# Altium project pca10184.PrjPcb (part 4 of 5)

## Sheet pca10184_connectors.SchDoc: =ProductName + ' - Connectors'
size A3; Organization: Nordic Semiconductor; DocumentNumber: 8; Revision: 0.7.0; SheetNumber: 8; SheetTotal: 9; Author: GETR; CompanyName: Nordic Semiconductor; DrawnBy: GETR; DocumentSize: A3; ProjectName: pca10184.PrjPcb
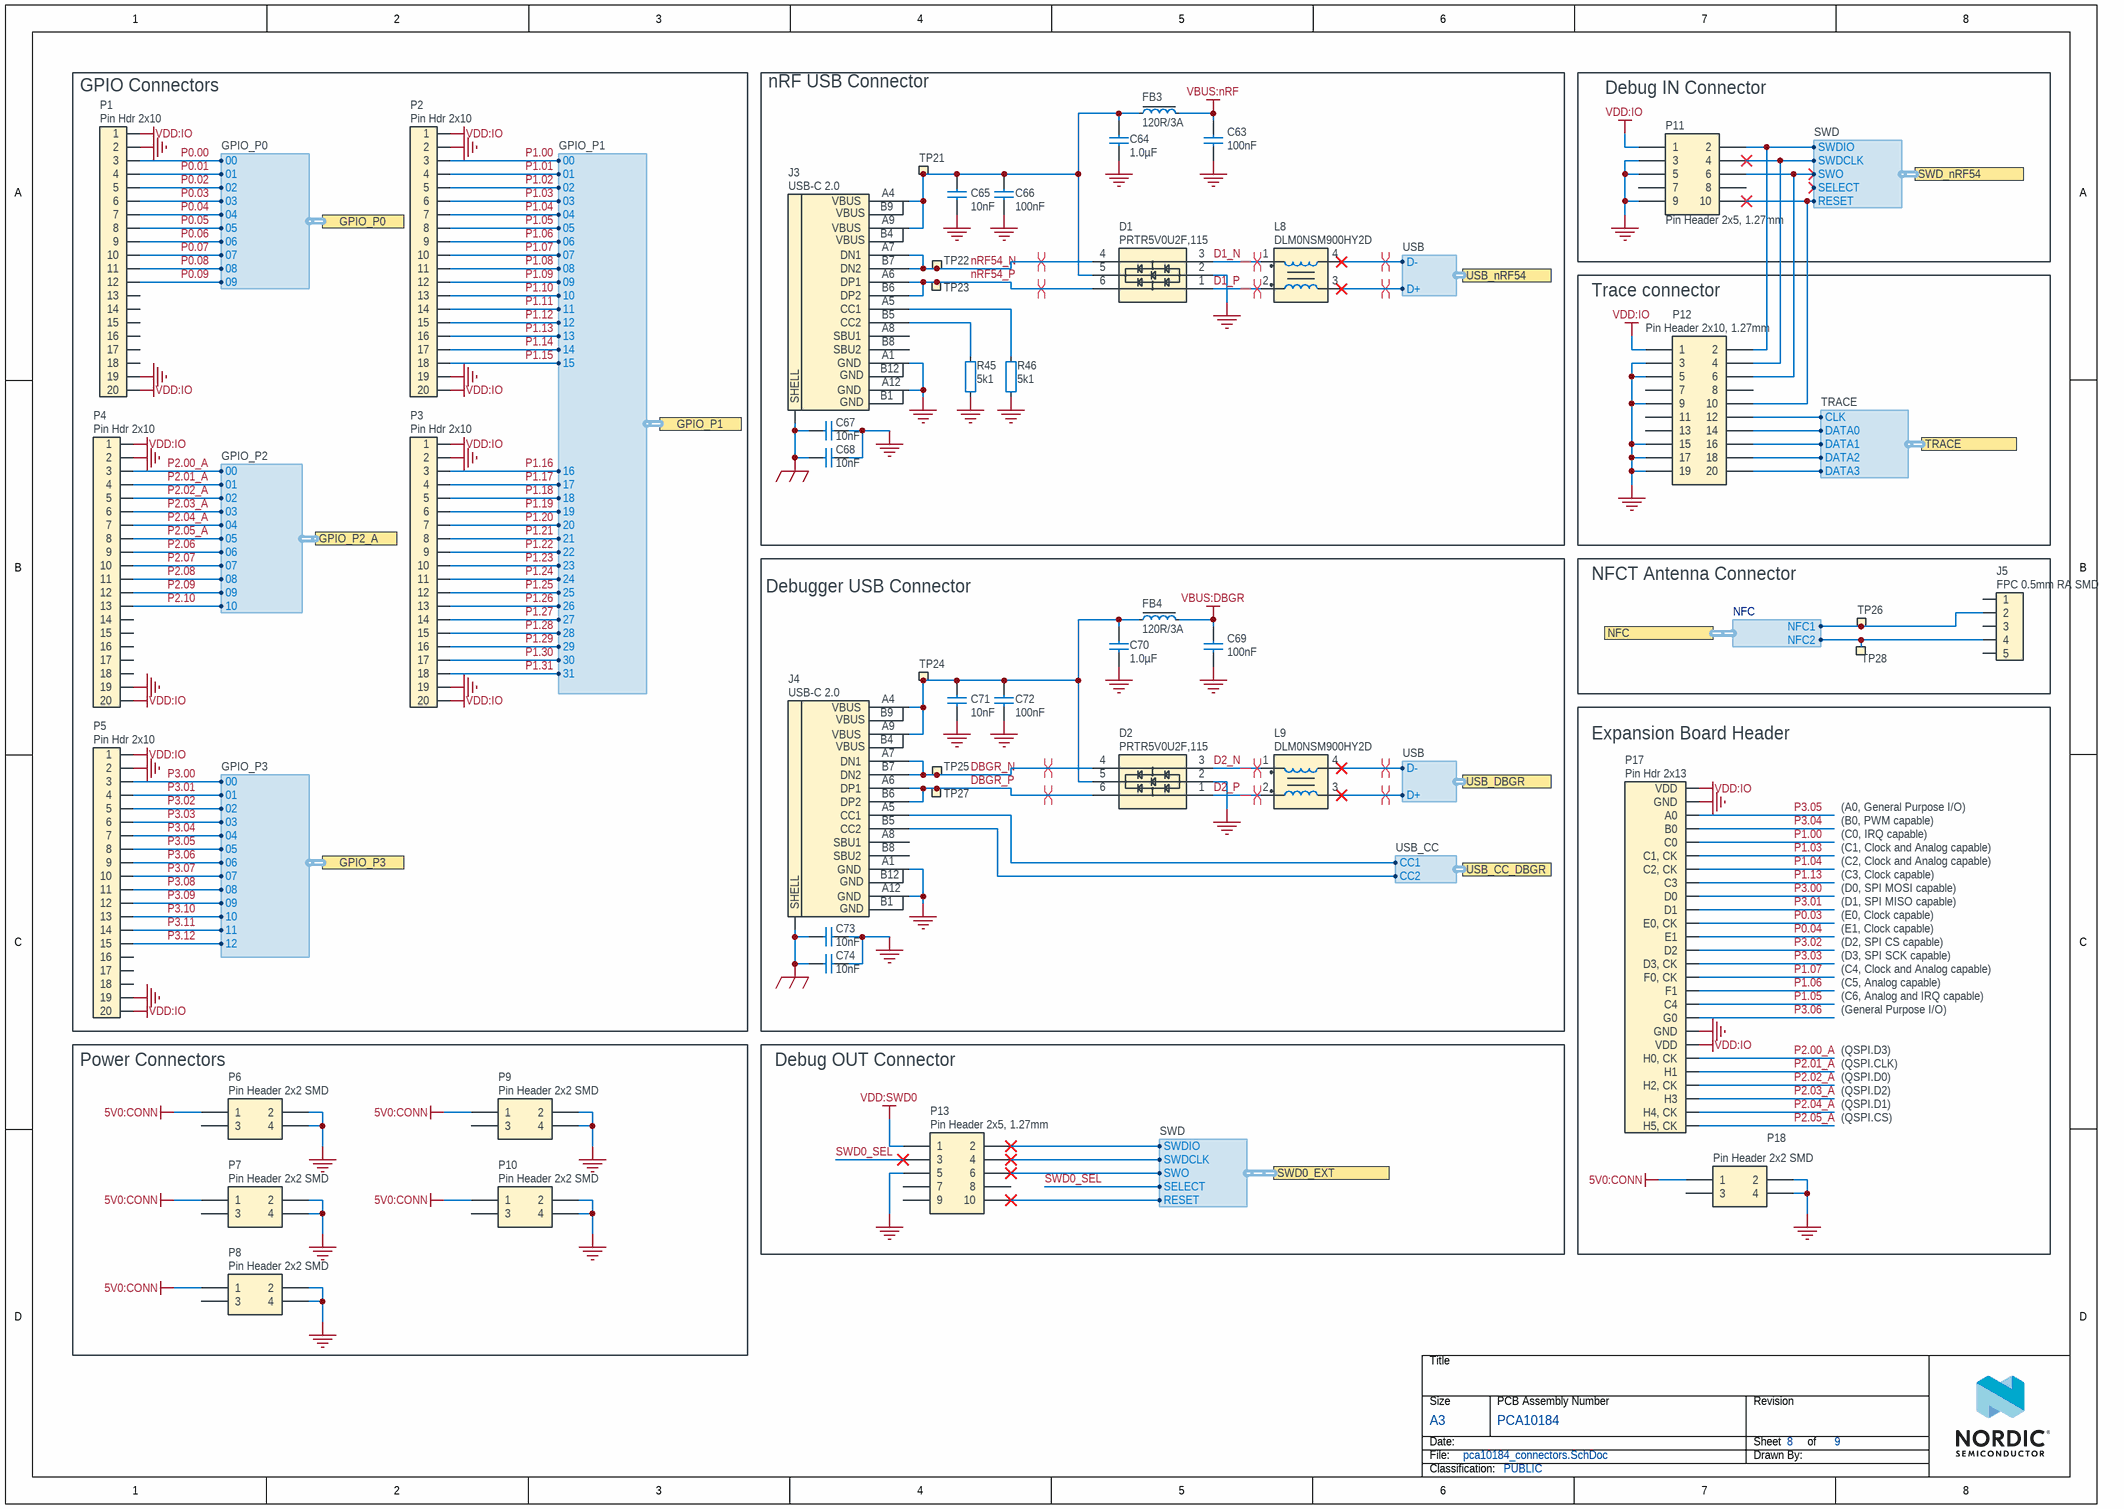
[diagram p4: pca10184_connectors.SchDoc]

### Parts
C63  100nF  [CAPC0603X03L_C]
C64  1.0µF  [CAPC1005X04L]
C65  10nF  [CAPC0603X03L_C]
C66  100nF  [CAPC0603X03L_C]
C67  10nF  [CAPC1005X04L]
C68  10nF  [CAPC1005X04L]
C69  100nF  [CAPC0603X03L_C]
C70  1.0µF  [CAPC1005X04L]
C71  10nF  [CAPC0603X03L_C]
C72  100nF  [CAPC0603X03L_C]
C73  10nF  [CAPC1005X04L]
C74  10nF  [CAPC1005X04L]
D1  PRTR5V0U2F,115  [SON50P100X50-6N]
D2  PRTR5V0U2F,115  [SON50P100X50-6N]
FB3  120R/3A  [INDC1608X06L]
FB4  120R/3A  [INDC1608X06L]
J3  USB-C 2.0  [SD-80259-001]
J4  USB-C 2.0  [SD-80259-001]
J5  FPC 0.5mm RA SMD  [FPC_05P-0.5mm-RA-SMD]
L8  DLM0NSM900HY2D  [CMC0806X05N]
L9  DLM0NSM900HY2D  [CMC0806X05N]
P1  Pin Hdr 2x10  [HDR_2x10-SMD]
P2  Pin Hdr 2x10  [HDR_2x10-SMD]
P3  Pin Hdr 2x10  [HDR_2x10-SMD]
P4  Pin Hdr 2x10  [HDR_2x10-SMD]
P5  Pin Hdr 2x10  [HDR_2x10-SMD]
P6  Pin Header 2x2 SMD  [HDR_2x2-SMD]
P7  Pin Header 2x2 SMD  [HDR_2x2-SMD]
P8  Pin Header 2x2 SMD  [HDR_2x2-SMD]
P9  Pin Header 2x2 SMD  [HDR_2x2-SMD]
P10  Pin Header 2x2 SMD  [HDR_2x2-SMD]
P11  Pin Header 2x5, 1.27mm  [HDR_2x5-SMD-1.27mm-K]
P12  Pin Header 2x10, 1.27mm  [HDR_2x10-SMD-1.27mm-NC]
P13  Pin Header 2x5, 1.27mm  [HDR_2x5-SMD-1.27mm-K]
P17  Pin Hdr 2x13  [HDR_2x13-SMD]
P18  Pin Header 2x2 SMD  [HDR_2x2-SMD]
R45  5k1  [RESC0603X03L_C]
R46  5k1  [RESC0603X03L_C]
TP21  Ø1.5mm,SMD  [TP_SMD_D1.5mm]  (value not drawn)  (no BOM)
TP22  Ø1.5mm,SMD  [TP_SMD_D1.5mm]  (value not drawn)  (no BOM)
TP23  Ø1.5mm,SMD  [TP_SMD_D1.5mm]  (value not drawn)  (no BOM)
TP24  Ø1.5mm,SMD  [TP_SMD_D1.5mm]  (value not drawn)  (no BOM)
TP25  Ø1.5mm,SMD  [TP_SMD_D1.5mm]  (value not drawn)  (no BOM)
TP26  Ø1.5mm,SMD  [TP_SMD_D1.5mm]  (value not drawn)  (no BOM)
TP27  Ø1.5mm,SMD  [TP_SMD_D1.5mm]  (value not drawn)  (no BOM)
TP28  Ø1.5mm,SMD  [TP_SMD_D1.5mm]  (value not drawn)  (no BOM)

### Blocks framed on the sheet
GPIO Connectors: P1-P5
nRF USB Connector: C63-C68 D1 FB3 J3 L8 R45 R46 TP21-TP23
Debug IN Connector: P11
Trace connector: P12
Debugger USB Connector: C69-C74 D2 FB4 J4 L9 TP24 TP25 TP27
NFCT Antenna Connector: J5 TP26 TP28
Expansion Board Header: P17 P18
Power Connectors: P6-P10
Debug OUT Connector: P13

### Ports
GPIO_P0 (harness GPIO_P0), GPIO_P1 (harness GPIO_P1), GPIO_P2_A (harness GPIO_P2), GPIO_P3 (harness GPIO_P3), NFC (harness NFC), SWD0_EXT (harness SWD), SWD_nRF54 (harness SWD), TRACE (harness TRACE), USB_CC_DBGR (harness USB_CC), USB_DBGR (harness USB), USB_nRF54 (harness USB)

### Harnesses
GPIO_P0: 00, 01, 02, 03, 04, 05, 06, 07, 08, 09
GPIO_P1: 00, 01, 02, 03, 04, 05, 06, 07, 08, 09, 10, 11, 12, 13, 14, 15, 16, 17, 18, 19, 20, 21, 22, 23, 24, 25, 26, 27, 28, 29, 30, 31
GPIO_P3: 00, 01, 02, 03, 04, 05, 06, 07, 08, 09, 10, 11, 12
SWD: SWDIO, SWDCLK, SWO, RESET, SELECT
USB: D+, D-
USB_CC: CC2, CC1
NFC: NFC2, NFC1
TRACE: CLK, DATA0, DATA1, DATA3, DATA2
GPIO_P2: 00, 01, 02, 03, 04, 05, 06, 07, 08, 09, 10

### Nets
5V0:CONN: P6.1 P7.1 P8.1 P9.1 P10.1 P18.1
GND: C63.1 C64.1 C65.1 C66.1 C67.2 C68.2 C69.1 C70.1 C71.1 C72.1 C73.2 C74.2 D1.2(GND) D2.2(GND) J3.A1(GND) J3.A12(GND) J4.A1(GND) J4.A12(GND) P1.2 P1.19 P2.2 P2.19 P3.2 P3.19 P4.2 P4.19 P5.2 P5.19 P6.2 P6.4 P7.2 P7.4 P8.2 P8.4 P9.2 P9.4 P10.2 P10.4 P11.3 P11.5 P11.9 P12.3 P12.5 P12.9 P12.15 P12.17 P12.19 P13.5 P17.2(GND) P17.19(GND) P18.2 P18.4 R45.1 R46.1
Shield: C67.1 C68.1 C73.1 C74.1 J3.SHLD(SHELL) J4.SHLD(SHELL)
VBUS:DBGR: C69.2 FB4.2
VBUS:nRF: C63.2 FB3.2
VDD:IO: P1.1 P1.20 P2.1 P2.20 P3.1 P3.20 P4.1 P4.20 P5.1 P5.20 P11.1 P12.1 P17.1(VDD) P17.20(VDD)
VDD:SWD0: P13.1
D1_N: D1.3(IO2) L8.1
D1_P: D1.1(IO1) L8.2
D2_N: D2.3(IO2) L9.1
D2_P: D2.1(IO1) L9.2
DBGR_N: D2.4(IO2) J4.A7(DN1) J4.B7(DN2) TP25.1
DBGR_P: D2.6(IO1) J4.A6(DP1) J4.B6(DP2) TP27.1
NFC1_N: J5.2 TP26.1 ; port NFC.NFC1
NFC2_P: J5.4 TP28.1 ; port NFC.NFC2
nRF54_N: D1.4(IO2) J3.A7(DN1) J3.B7(DN2) TP22.1
nRF54_P: D1.6(IO1) J3.A6(DP1) J3.B6(DP2) TP23.1
nRF54_RESET: P11.10 P12.10 ; port SWD_nRF54.RESET
P0.00: P1.3 ; port GPIO_P0.00
P0.01: P1.4 ; port GPIO_P0.01
P0.02: P1.5 ; port GPIO_P0.02
P0.03: P1.6 P17.11(E0,_CK) ; port GPIO_P0.03
P0.04: P1.7 P17.12(E1) ; port GPIO_P0.04
P0.05: P1.8 ; port GPIO_P0.05
P0.06: P1.9 ; port GPIO_P0.06
P0.07: P1.10 ; port GPIO_P0.07
P0.08: P1.11 ; port GPIO_P0.08
P0.09: P1.12 ; port GPIO_P0.09
P1.00: P2.3 P17.5(C0) ; port GPIO_P1.00
P1.01: P2.4 ; port GPIO_P1.01
P1.02: P2.5 ; port GPIO_P1.02
P1.03: P2.6 P17.6(C1,_CK) ; port GPIO_P1.03
P1.04: P2.7 P17.7(C2,_CK) ; port GPIO_P1.04
P1.05: P2.8 P17.17(C4) ; port GPIO_P1.05
P1.06: P2.9 P17.16(F1) ; port GPIO_P1.06
P1.07: P2.10 P17.15(F0,_CK) ; port GPIO_P1.07
P1.08: P2.11 ; port GPIO_P1.08
P1.09: P2.12 ; port GPIO_P1.09
P1.10: P2.13 ; port GPIO_P1.10
P1.11: P2.14 ; port GPIO_P1.11
P1.12: P2.15 ; port GPIO_P1.12
P1.13: P2.16 P17.8(C3) ; port GPIO_P1.13
P1.14: P2.17 ; port GPIO_P1.14
P1.15: P2.18 ; port GPIO_P1.15
P1.16: P3.3 ; port GPIO_P1.16
P1.17: P3.4 ; port GPIO_P1.17
P1.18: P3.5 ; port GPIO_P1.18
P1.19: P3.6 ; port GPIO_P1.19
P1.20: P3.7 ; port GPIO_P1.20
P1.21: P3.8 ; port GPIO_P1.21
P1.22: P3.9 ; port GPIO_P1.22
P1.23: P3.10 ; port GPIO_P1.23
P1.24: P3.11 ; port GPIO_P1.24
P1.25: P3.12 ; port GPIO_P1.25
P1.26: P3.13 ; port GPIO_P1.26
P1.27: P3.14 ; port GPIO_P1.27
P1.28: P3.15 ; port GPIO_P1.28
P1.29: P3.16 ; port GPIO_P1.29
P1.30: P3.17 ; port GPIO_P1.30
P1.31: P3.18 ; port GPIO_P1.31
P2.00_A: P4.3 P17.21(H0,_CK) ; port GPIO_P2_A.00
P2.01_A: P4.4 P17.22(H1) ; port GPIO_P2_A.01
P2.02_A: P4.5 P17.23(H2,_CK) ; port GPIO_P2_A.02
P2.03_A: P4.6 P17.24(H3) ; port GPIO_P2_A.03
P2.04_A: P4.7 P17.25(H4,_CK) ; port GPIO_P2_A.04
P2.05_A: P4.8 P17.26(H5,_CK) ; port GPIO_P2_A.05
P2.06: P4.9 P12.12 ; port TRACE.CLK, port GPIO_P2_A.06
P2.07: P4.10 P11.6 P12.6 P12.14 ; port SWD_nRF54.SWO, port TRACE.DATA0, port GPIO_P2_A.07
P2.08: P4.11 P12.16 ; port TRACE.DATA1, port GPIO_P2_A.08
P2.09: P4.12 P12.18 ; port TRACE.DATA2, port GPIO_P2_A.09
P2.10: P4.13 P12.20 ; port TRACE.DATA3, port GPIO_P2_A.10
P3.00: P5.3 P17.9(D0) ; port GPIO_P3.00
P3.01: P5.4 P17.10(D1) ; port GPIO_P3.01
P3.02: P5.5 P17.13(D2) ; port GPIO_P3.02
P3.03: P5.6 P17.14(D3,_CK) ; port GPIO_P3.03
P3.04: P5.7 P17.4(B0) ; port GPIO_P3.04
P3.05: P5.8 P17.3(A0) ; port GPIO_P3.05
P3.06: P5.9 P17.18(G0) ; port GPIO_P3.06
P3.07: P5.10 ; port GPIO_P3.07
P3.08: P5.11 ; port GPIO_P3.08
P3.09: P5.12 ; port GPIO_P3.09
P3.10: P5.13 ; port GPIO_P3.10
P3.11: P5.14 ; port GPIO_P3.11
P3.12: P5.15 ; port GPIO_P3.12
SWD0_CLK_EXT: P13.6 ; port SWD0_EXT.SWO
SWD0_IO_EXT: P13.10 ; port SWD0_EXT.RESET
SWD0_RESET_EXT: P13.2 ; port SWD0_EXT.SWDIO
SWD0_SEL: P13.3 ; port SWD0_EXT.SELECT
SWD0_SWO_EXT: P13.4 ; port SWD0_EXT.SWDCLK
SWDCLK: P11.4 P12.4 ; port SWD_nRF54.SWDCLK
SWDIO: P11.2 P12.2 ; port SWD_nRF54.SWDIO
USB_DBGR_N: L9.4 ; port USB_DBGR.D-
USB_DBGR_P: L9.3 ; port USB_DBGR.D+
USB_nRF54_D+: L8.3 ; port USB_nRF54.D+
USB_nRF54_D-: L8.4 ; port USB_nRF54.D-
NetC64_2: C64.2 C65.2 C66.2 D1.5(VCC) FB3.1 J3.A4(VBUS) J3.A9(VBUS) TP21.1
NetC70_2: C70.2 C71.2 C72.2 D2.5(VCC) FB4.1 J4.A4(VBUS) J4.A9(VBUS) TP24.1
NetJ3_A5: J3.A5(CC1) R46.2
NetJ3_B5: J3.B5(CC2) R45.2
NetJ4_A5: J4.A5(CC1) ; port USB_CC_DBGR.CC1
NetJ4_B5: J4.B5(CC2) ; port USB_CC_DBGR.CC2

Not connected (* = marked no-connect by the designer): J3 A8(SBU1) B8(SBU2); J4 A8(SBU1) B8(SBU2); J5 1 3 5; P1 13 14 15 16 17 18; P4 14 15 16 17 18; P5 16 17 18; P6 3; P7 3; P8 3; P9 3; P10 3; P11 7 8; P12 7 8 11 13; P13 7 8 9; P18 3

### Layout directives
differential pair; differential pair class nRF54; net class USB: DBGR_N, DBGR_P, nRF54_N, nRF54_P
differential pair; differential pair class IMCU; net class USB: D1_N, D1_P, D2_N, D2_P, USB_DBGR_N, USB_DBGR_P, USB_nRF54_D+, USB_nRF54_D-

### Notes on the sheet
- (C1, Clock and Analog capable)
- (C0, IRQ capable)
- (B0, PWM capable)
- (A0, General Purpose I/O)
- (C2, Clock and Analog capable)
- (C3, Clock capable)
- (E0, Clock capable)
- (D0, SPI MOSI capable)
- (D1, SPI MISO capable)
- (C4, Clock and Analog capable)
- (C5, Analog capable)
- (E1, Clock capable)
- (D3, SPI SCK capable)
- (D2, SPI CS capable)
- (C6, Analog and IRQ capable)
- (QSPI.D3)
- (General Purpose I/O)
- (QSPI.D2)
- (QSPI.D0)
- (QSPI.D1)
- (QSPI.CS)
- (QSPI.CLK)
- Title
- Size
- Date:
- File:
- A3
- PCB Assembly Number
- Sheet
- Drawn By:
- Revision
- of
- Classification:
- (in symbol 80259-1021) B9; B4; B12; B1

### Library data of the parts
C63 C66 C69 C72 = C0201-100n: Capacitor, X5R, ±10%, 100nF, 16V; Manufacturer: N.A.; Part number IPS: 00000001248, 00000002505; Part number Norautron: 262071862; Part number NEMS: 100200078; Pad Count: 2; Component Status: Active; Part Number: C0201-100n; Manufacturer Part Number: N.A.; LatestRevisionDate: 2024-06-27; Published: 2014-11-13; Value: 100nF; Note: 16V; Artikkelnr Noca: N.A.; Footprint Doc: 0201; ComponentLink1URL: N.A.; ComponentLink1Description: Datasheet; ComponentLink2URL: N.A.; ComponentLink2Description: Supplier link; HelpURL: N.A.; Supplier 1: N.A.; Supplier Part Number 1: N.A.; Supplier 2: N.A.; Supplier Part Number 2: N.A.; Component Class: Capacitors; PartId: 100200078; Author: rsk
C64 C70 = C0402-1µ0-16V-X5R: Capacitor, Ceramic, X5R, ±10%, 16V; Manufacturer: Murata; Manufacturer Part Number: GRT155R61C105KE01D; Part number NEMS: 100200452; Artikkelnr Noca: N.A.; Pad Count: 2; Component Status: Active; Part Number: C0402-1µ0-16V-X5R; Footprint Doc: 0402; LatestRevisionDate: 2020-12-15; Published: 2020-12-15; Value: 1.0µF; Note: 16V; Part number IPS: N.A.; ComponentLink1URL: https://search.murata.co.jp/Ceramy/image/img/A01X/G101/ENG/GRT155R61C105KE01-01.pdf; ComponentLink1Description: Datasheet; ComponentLink2URL: https://www.murata.com/en-global/products/productdetail?partno=GRT155R61C105KE01%23; ComponentLink2Description: Supplier link; HelpURL: N.A.; Supplier 1: Digi-Key; Supplier Part Number 1: 490-12255-1-ND; Supplier 2: Mouser; Supplier Part Number 2: 81-GRT155R61C105KE1D; Component Class: Capacitors; PartId: 100200452; Author: rsk; Part number Norautron: N.A.
C65 C71 = C0201-10n: Capacitor, X7R, ±10%, 10nF, 10V; Manufacturer: N.A.; Part number IPS: 00000003480; Part number Norautron: 26621779; Part number NEMS: 100200067; Pad Count: 2; Component Status: Active; Part Number: C0201-10n; Manufacturer Part Number: N.A.; LatestRevisionDate: 2024-06-27; Published: 2014-11-13; Value: 10nF; Note: 10V; Artikkelnr Noca: N.A.; Footprint Doc: 0201; ComponentLink1URL: N.A.; ComponentLink1Description: Datasheet; ComponentLink2URL: N.A.; ComponentLink2Description: Supplier link; HelpURL: N.A.; Supplier 1: N.A.; Supplier Part Number 1: N.A.; Supplier 2: N.A.; Supplier Part Number 2: N.A.; Component Class: Capacitors; PartId: 100200067; Author: rsk
C67 C68 C73 C74 = C0402-10n: Capacitor, X7R, ±10%; Manufacturer: N.A.; Part number IPS: 00000007784; Part number NEMS: 100200173; Component Status: Active; Pad Count: 2; Note: 16V; Artikkelnr Noca: 20039166; Part Number: C0402-10n; PartId: 100200173; Component Class: Capacitors; Author: rsk; Manufacturer Part Number: N.A.; ComponentLink1URL: N.A.; ComponentLink1Description: Datasheet; ComponentLink2URL: N.A.; ComponentLink2Description: Supplier link; HelpURL: N.A.; LatestRevisionDate: 2009-11-23; Published: 2009-05-08; Footprint Doc: 0402; Value: 10nF; Supplier 1: N.A.; Supplier Part Number 1: N.A.; Supplier 2: N.A.; Supplier Part Number 2: N.A.; Part number Norautron: N.A.
D1 D2 = PRTR5V0U2F,115: TVS DIODE 5.5VWM 6XSON; Manufacturer: Nexperia; Part number NEMS: 101300202; Component Status: Active; Pad Count: 6; Note: N.A.; Part Number: PRTR5V0U2F,115; PartId: 101300202; Component Class: Semiconductors; Author: rsk; Manufacturer Part Number: PRTR5V0U2F,115; ComponentLink1URL: https://assets.nexperia.com/documents/data-sheet/PRTR5V0U2F_PRTR5V0U2K.pdf; ComponentLink1Description: Datasheet; ComponentLink2URL: https://www.digikey.com/en/products/detail/nexperia-usa-inc/PRTR5V0U2F-115/1992982; ComponentLink2Description: Supplier link; HelpURL: https://www.nexperia.com/products/esd-protection-tvs-filtering-and-signal-conditioning/automotive-esd-protection-and-tvs/automotive-esd-protection/PRTR5V0U2F.html; LatestRevisionDate: 2023-02-19; Published: 2023-02-19; Footprint Doc: SOT886; Value: PRTR5V0U2F,115; Supplier 1: DigiKey; Supplier Part Number 1: 1727-4161-1-ND; Supplier 2: Mouser; Supplier Part Number 2: 771-PRTR5V0U2F-T/R; Artikkelnr Noca: N.A.; Part number IPS: N.A.; Part number Norautron: N.A.
FB3 FB4 = FB0603-120R@100MHz-3000mA: Ferrite Bead, 120 Ohm @ 100MHz, 3000mA, 30 mOhm Max; Manufacturer: Murata; Manufacturer Part Number: BLM18KG121TN1D; Part number NEMS: 100300103; Component Status: Active; Pad Count: 2; Note: Chip EMIFIL Inductor Type Chip Ferrite Bead; Artikkelnr Noca: N.A.; Part Number: FB0603-120R@100MHz-3000mA; PartId: 100300103; Component Class: Inductors; Author: rsk; ComponentLink1URL: N.A.; ComponentLink1Description: Datasheet; ComponentLink2URL: http://www.murata.com/en-global/products/productdata/8796733767710/S0580E.pdf; ComponentLink2Description: Supplier link; HelpURL: http://www.murata.com/en-global/products/productdata/8796733767710/S0580E.pdf; LatestRevisionDate: 2017-08-15; Published: 2017-08-15; Footprint Doc: 0603; Value: 120R/3A; Supplier 1: Digi-Key; Supplier Part Number 1: 490-5254-1-ND; Supplier 2: N.A.; Supplier Part Number 2: N.A.; Part number IPS: N.A.; Part number Norautron: N.A.
J3 J4 = 80259-1021: USB-C Receptacle, 16 Pin, USB 2.0; Manufacturer: Bellweather Electronic Corp.; Part number NEMS: 100500830; Component Status: Active; Pad Count: 16; Note: N.A.; System: Connector; Part Number: 80259-1021; PartId: 100500830; Component Class: Connectors; Author: getr; Manufacturer Part Number: 80259-1021; ComponentLink1URL: \\hizz\pro\app9717\Datasheet\connectors\Bellwether\SD-80259-001_C.pdf; ComponentLink1Description: Datasheet; ComponentLink2URL: N.A.; ComponentLink2Description: Supplier link; HelpURL: N.A.; LatestRevisionDate: 2024-03-26; Published: 2023-10-30; Footprint Doc: SD-80259-001; Value: USB-C 2.0; Supplier 1: Cabcon; Supplier Part Number 1: 80259-1021; Supplier 2: N.A.; Supplier Part Number 2: N.A.; Artikkelnr Noca: N.A.; Part number IPS: N.A.; Part number Norautron: N.A.
J5 = FPC_05P-0.5mm-RA-SMD: 0.5mm FPC, 5P,Right Angle SMT,Double Contact,H=1.2mm,White, Tin plated; Manufacturer: WCON; Manufacturer Part Number: 5141-05RZDNWR03; Part number NEMS: 100500528; Note: (Replaced 5141-05RZDNWR02); Artikkelnr Noca: N.A.; Pad Count: 7; Component Status: Active; System: Connector; Part Number: FPC_05P-0.5mm-RA-SMD; Footprint Doc: FPC_05P-0.5mm-RA-SMD; LatestRevisionDate: 2024-02-02; Published: 2015-06-22; Value: FPC 0.5mm RA SMD; Part number IPS: N.A.; ComponentLink1URL: N.A.; ComponentLink1Description: Datasheet; ComponentLink2URL: N.A.; ComponentLink2Description: Supplier link; HelpURL: \\hizz\pro\app9717\Datasheet\connectors\W-CON\5141-05RZDNXX02.pdf; Supplier 1: Cabcon; Supplier Part Number 1: 5141-05RZDNWR03; Supplier 2: N.A.; Supplier Part Number 2: N.A.; Component Class: Connectors; PartId: 100500528; Author: rsk; Part number Norautron: N.A.
L8 L9 = DLM0NSM900HY2D: 2 Line Common Mode Choke, 90Ohm @ 100MHz, Imax=100mA, DCR=4Ohm, VDC=5V,  -40°C ~ 85°C; Manufacturer: Murata Electronics; Part number NEMS: 100300513; Component Status: Active; Pad Count: 4; Note: N.A.; Part Number: DLM0NSM900HY2D; Component Class: Inductors; Author: rubr; Manufacturer Part Number: DLM0NSM900HY2D; ComponentLink1URL: https://www.murata.com/en-global/products/productdata/8799424610334/EFLD0009.pdf; ComponentLink1Description: Datasheet; ComponentLink2URL: https://www.digikey.com/en/products/detail/murata-electronics/DLM0NSM900HY2D/11685874; ComponentLink2Description: Supplier link; HelpURL: https://pim.murata.com/en-sg/pim/details/?partNum=DLM0NSM900HY2%23; LatestRevisionDate: 2025-09-01; Published: 2025-09-01; Footprint Doc: CMC0806X05N; Value: DLM0NSM900HY2D; Supplier 1: DigiKey; Supplier Part Number 1: 490-DLM0NSM900HY2DCT-ND; Supplier 2: N.A.; Supplier Part Number 2: N.A.; Artikkelnr Noca: N.A.; Part number IPS: N.A.; Part number Norautron: N.A.; PartId: 100300513
P1-P5 = Pin Header 2x10 SMD, 2.54mm: Pin Header 2x10, 2.54mm (100mil) SMD; Manufacturer: WCON; Manufacturer Part Number: 1125-1210S0M116CR09; Part number NEMS: 100500738; Pad Count: 20; Artikkelnr Noca: N.A.; Component Status: Active; System: Connector; Part Number: Pin Header 2x10 SMD, 2.54mm; Component Class: Connectors; Author: stl1; ComponentLink1URL: https://suddendocs.samtec.com/catalog_english/tsm.pdf; ComponentLink1Description: Datasheet; ComponentLink2URL: https://www.digikey.no/en/products/detail/samtec-inc/TSM-110-02-S-DV/6679037; ComponentLink2Description: Supplier link; HelpURL: https://www.samtec.com/products/tsm-110-02-s-dv; Footprint Doc: HDR_2x10-SMD-2.54MM; LatestRevisionDate: 2024-02-21; Published: 2022-01-24; Value: Pin Hdr 2x10; Note: SMD; Supplier 1: Cabcon; Supplier Part Number 1: 1125-1210S0M116CR09; Supplier 2: Samtec; Supplier Part Number 2: TSM-110-01-S-DV; Part number IPS: N.A.; Part number Norautron: N.A.; PartId: 100500738
P6-P10 P18 = Pin Header 2x2 SMD: Pin Header 2x2, SMD, 2.54mm (100mil); Manufacturer: WCON; Manufacturer Part Number: 1125-1202S0M116CR03; Part number NEMS: 100500770; Component Status: Active; Pad Count: 4; Note: N.A.; System: Connector; Part Number: Pin Header 2x2 SMD; Component Class: Connectors; Author: stl1; ComponentLink1URL: N.A.; ComponentLink1Description: Datasheet; ComponentLink2URL: N.A.; ComponentLink2Description: Supplier link; HelpURL: N.A.; LatestRevisionDate: 2024-02-21; Published: 2022-10-28; Footprint Doc: HDR_2x2-SMD; Value: Pin Header 2x2 SMD; Supplier 1: Cabcon; Supplier Part Number 1: 1125-1202S0M116CR03; Supplier 2: Samtec; Supplier Part Number 2: TSM-102-01-S-DV; Artikkelnr Noca: N.A.; Part number IPS: N.A.; Part number Norautron: N.A.; PartId: 100500770
P11 = Pin Header 2x5 SMD, 1.27mm, KS: Pin Header 2x5, 1.27mm (50mil), SMD, Keying Shroud; Manufacturer: WCON; Manufacturer Part Number: 3132-10MS0BK00R5; Part number NEMS: 100500261; Note: (Replaced 3132-10MS0BK00R1); Artikkelnr Noca: N.A.; Assembly: Not mounted; Pad Count: 10; Component Status: Active; System: Connector; Part Number: Pin Header 2x5 SMD, 1.27mm, KS; Footprint Doc: HDR_2x5-SMD-1.27mm; LatestRevisionDate: 2024-02-02; Published: 2016-01-22; Value: Pin Header 2x5, 1.27mm; Part number IPS: N.A.; ComponentLink1URL: N.A.; ComponentLink1Description: Datasheet; ComponentLink2URL: N.A.; ComponentLink2Description: Supplier link; HelpURL: \\hizz\pro\app9717\Datasheet\connectors\W-CON\3132-XXMXXBK00XX.pdf; Supplier 1: Cabcon; Supplier Part Number 1: 3132-10MS0BK00R5; Supplier 2: N.A.; Supplier Part Number 2: N.A.; Component Class: Connectors; PartId: 100500261; Author: rsk; Part number Norautron: N.A.
P12 = Pin Header 2x10 SMD, 1.27mm, KS, N.C.: Pin Header 2x10, 1.27mm (50mil), SMD, Keying Shroud; Manufacturer: WCON; Manufacturer Part Number: 3132-20MS0BK00R1; Part number NEMS: 100500279; Note: N.A.; Assembly: Not mounted; Pad Count: 20; Component Status: Active; System: Connector; Part Number: Pin Header 2x10 SMD, 1.27mm, KS, N.C.; LatestRevisionDate: 2017-10-23; Published: 2017-09-07; Value: Pin Header 2x10, 1.27mm; Artikkelnr Noca: N.A.; Footprint Doc: HDR_2x10-SMD-1.27mm; Part number IPS: N.A.; ComponentLink1URL: N.A.; ComponentLink1Description: Datasheet; ComponentLink2URL: N.A.; ComponentLink2Description: Supplier link; HelpURL: N.A.; Supplier 1: Cabcon; Supplier Part Number 1: 3132-20MS0BK00R1; Supplier 2: Digi-Key; Supplier Part Number 2: FTSH-110-01-F-DV-K-ND; Component Class: Connectors; PartId: 100500279; Author: rsk; Part number Norautron: N.A.
P13 = Pin Header 2x5 SMD, 1.27mm, KS: Pin Header 2x5, 1.27mm (50mil), SMD, Keying Shroud; Manufacturer: WCON; Manufacturer Part Number: 3132-10MS0BK00R5; Part number NEMS: 100500261; Note: (Replaced 3132-10MS0BK00R1); Artikkelnr Noca: N.A.; Pad Count: 10; Component Status: Active; System: Connector; Part Number: Pin Header 2x5 SMD, 1.27mm, KS; Footprint Doc: HDR_2x5-SMD-1.27mm; LatestRevisionDate: 2024-02-02; Published: 2016-01-22; Value: Pin Header 2x5, 1.27mm; Part number IPS: N.A.; ComponentLink1URL: N.A.; ComponentLink1Description: Datasheet; ComponentLink2URL: N.A.; ComponentLink2Description: Supplier link; HelpURL: \\hizz\pro\app9717\Datasheet\connectors\W-CON\3132-XXMXXBK00XX.pdf; Supplier 1: Cabcon; Supplier Part Number 1: 3132-10MS0BK00R5; Supplier 2: N.A.; Supplier Part Number 2: N.A.; Component Class: Connectors; PartId: 100500261; Author: rsk; Part number Norautron: N.A.
P17 = Pin Header 2x13 SMD, 2.54mm: Pin Header 2x13, 2.54mm (100mil) SMD; Manufacturer: WCON; Manufacturer Part Number: 1125-1213S0M116CR09; Part number NEMS: 100500908; Component Status: Active; Pad Count: 26; Artikkelnr Noca: N.A.; System: Connector; Part Number: Pin Header 2x13 SMD, 2.54mm; Component Class: Connectors; Author: getr; ComponentLink1URL: https://suddendocs.samtec.com/catalog_english/tsm.pdf; ComponentLink1Description: Datasheet; ComponentLink2URL: https://www.digikey.no/no/products/detail/samtec-inc/tsm-113-01-s-dv/6679042; ComponentLink2Description: Supplier link; HelpURL: https://www.samtec.com/products/tsm-113-01-s-dv; LatestRevisionDate: 2025-05-25; Published: 2025-05-25; Footprint Doc: HDR_2x13-SMD-2.54MM; Value: Pin Hdr 2x13; Note: SMD; Supplier 1: Cabcon; Supplier Part Number 1: 1125-1213S0M116CR09; Supplier 2: Samtec; Supplier Part Number 2: TSM-113-01-S-DV; Part number IPS: N.A.; Part number Norautron: N.A.; PartId: 100500908
R45 R46 = R0201-5k1: Resistor, ±1%, 0.05W; Manufacturer: N.A.; Part number Norautron: 26192285; Part number NEMS: 100100565; Pad Count: 2; Note: Chip Res 1%; Component Status: Active; Part Number: R0201-5k1; PartId: 100100565; Component Class: Resistors; Author: rsk; Manufacturer Part Number: N.A.; ComponentLink1URL: N.A.; ComponentLink1Description: Datasheet; ComponentLink2URL: N.A.; ComponentLink2Description: Supplier link; HelpURL: N.A.; Footprint Doc: 0201; LatestRevisionDate: 2016-04-20; Published: 2016-04-20; Value: 5k1; Supplier 1: N.A.; Supplier Part Number 1: N.A.; Supplier 2: N.A.; Supplier Part Number 2: N.A.; Artikkelnr Noca: N.A.; Part number IPS: N.A.
TP21-TP28 = TP_SMD_Ø1.5MM: 1.5mm circular SMD testpad; Manufacturer: Nordic Semiconductor; Manufacturer Part Number: N.A.; Part number NEMS: 100500477; Pad Count: 1; Component Status: Active; Part Number: TP_SMD_Ø1.5MM; LatestRevisionDate: 2021-03-05; Published: 2016-06-02; Value: Ø1.5mm,SMD; Note: N.A.; Artikkelnr Noca: N.A.; Footprint Doc: TP_SMD_Ø1.5mm; Part number IPS: N.A.; ComponentLink1URL: N.A.; ComponentLink1Description: Datasheet; ComponentLink2URL: N.A.; ComponentLink2Description: Supplier link; HelpURL: N.A.; Supplier 1: N.A.; Supplier Part Number 1: N.A.; Supplier 2: N.A.; Supplier Part Number 2: N.A.; Component Class: Connectors; PartId: 100500477; Author: rsk; Part number Norautron: N.A.

## Sheet pca10184_mechanical.SchDoc: =ProductName + ' - Mechanical'
size A4; Organization: Nordic Semiconductor; DocumentNumber: 9; Revision: 0.7.0; SheetNumber: 9; SheetTotal: 9; Author: GETR; CompanyName: Nordic Semiconductor; DrawnBy: GETR; DocumentSize: A4; ProjectName: pca10184.PrjPcb
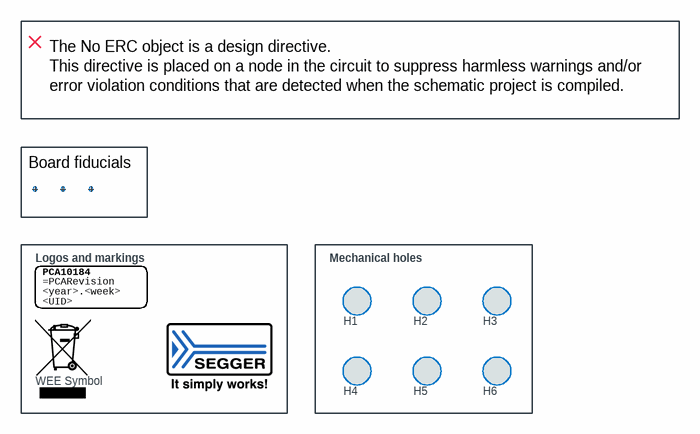
[diagram p5: pca10184_mechanical.SchDoc]

### Parts
Fid1  Fiducial mark  [Fiducial]  (value not drawn)
Fid2  Fiducial mark  [Fiducial]  (value not drawn)
Fid3  Fiducial mark  [Fiducial]  (value not drawn)
H1  MountingHole_NPTH  [MountingHole_3.2_M3]  (value not drawn)  (no BOM)
H2  MountingHole_NPTH  [MountingHole_3.2_M3]  (value not drawn)  (no BOM)
H3  MountingHole_NPTH  [MountingHole_3.2_M3]  (value not drawn)  (no BOM)
H4  MountingHole_NPTH  [MountingHole_3.2_M3]  (value not drawn)  (no BOM)
H5  MountingHole_NPTH  [MountingHole_3.2_M3]  (value not drawn)  (no BOM)
H6  MountingHole_NPTH  [MountingHole_3.2_M3]  (value not drawn)  (no BOM)
LABEL1  12x12mm  [LabelSilk_12x12]  (value not drawn)
LOGO1  WEE Symbol  [WEE_3x4.5mm]  (no BOM)
LOGO3  Segger Logo S  [SEGGER_LOGO_S]  (value not drawn)  (no BOM)

### Blocks framed on the sheet
Logos and markings: LABEL1 LOGO1 LOGO3
Mechanical holes: H1-H6

### Notes on the sheet
- The No ERC object is a design directive.
  This directive is placed on a node in the circuit to suppress harmless warnings and/or error violation conditions that are detected when the schematic project is compiled.
- Board fiducials
- Title
- Size
- Date:
- File:
- A4
- PCB Assembly Number
- Sheet
- Drawn By:
- Revision
- of
- Classification:
- (in symbol Label_12x12) <year>.<week>; <UID>

### Library data of the parts
Fid1-Fid3 = Fid-Mark: Manufacturer: N.A.; Part number NEMS: 100500073; Value: N.A.; Pad Count: 1; Component Status: Active; System: Connector; Part Number: Fid-Mark; Manufacturer Part Number: N.A.; LatestRevisionDate: 2009-12-12; Published: 2009-12-12; Note: N.A.; Artikkelnr Noca: N.A.; Footprint Doc: Fiducial; Part number IPS: N.A.; ComponentLink1URL: N.A.; ComponentLink1Description: Datasheet; ComponentLink2URL: N.A.; ComponentLink2Description: Supplier link; HelpURL: N.A.; Supplier 1: N.A.; Supplier Part Number 1: N.A.; Supplier 2: N.A.; Supplier Part Number 2: N.A.; PartId: 100500073; Component Class: Connectors; Author: rsk; Part number Norautron: N.A.
H1-H6 = MountingHole_3.2_M3: Mounting hole, 3.2mm, M3, no annular; Manufacturer: N.A.; Part number NEMS: 101200008; Rule: UNIONINDEX=0|RULEKIND=Clearance|NETSCOPE=DifferentNets|LAYERKIND=SameLayer|NAME=Schematic Clearance Constraint|GAP=10mil|GENERICCLEARANCE=10mil|IGNOREPADTOPADCLEARANCEINFOOTPRINT=TRUE|OBJECTCLEARANCES=ClearanceObj_Arc-ClearanceObj_Hole:0;ClearanceObj_Track-ClearanceObj_Hole:0;ClearanceObj_SMDPad-ClearanceObj_Hole:0;ClearanceObj_THPad-ClearanceObj_Hole:0;ClearanceObj_Via-ClearanceObj_Hole:0;ClearanceObj_Fill-ClearanceObj_Hole:0;ClearanceObj_Poly-ClearanceObj_Hole:0;ClearanceObj_Region-ClearanceObj_Hole:0;ClearanceObj_Text-ClearanceObj_Hole:0|UNIT=Metric; Rule: UNIONINDEX=0|RULEKIND=RoutingVias|NETSCOPE=AnyNet|LAYERKIND=SameLayer|NAME=Schematic Routing Via Style|HOLEWIDTH=0mil|WIDTH=0mil|VIASTYLE=Through Hole|MINHOLEWIDTH=0mil|MINWIDTH=0mil|MAXHOLEWIDTH=78.7402mil|MAXWIDTH=78.7402mil|UNIT=Metric; Component Status: Active; Pad Count: 0; Part Number: MountingHole_3.2_M3; PartId: 101200008; Component Class: Mechanicals; Author: kod1; Manufacturer Part Number: N.A.; ComponentLink1URL: N.A.; ComponentLink1Description: Datasheet; ComponentLink2URL: N.A.; ComponentLink2Description: Supplier link; HelpURL: N.A.; LatestRevisionDate: 2022-12-16; Published: 2022-12-16; Footprint Doc: MountingHole_3.2_M3; Value: MountingHole_3.2_M3; Note: N.A.; Supplier 1: N.A.; Supplier Part Number 1: N.A.; Supplier 2: N.A.; Supplier Part Number 2: N.A.; Artikkelnr Noca: N.A.; Part number IPS: N.A.; Part number Norautron: N.A.
LABEL1 = Label_12x12: PCA version label, stick-on, 12x12mm; Manufacturer: Ellco Etikett; Manufacturer Part Number: A33512‐01; Part number NEMS: 101200028; Component Status: Active; Pad Count: 0; Note: N.A.; Part Number: Label_12x12; PartId: 101200028; Component Class: Mechanicals; Author: hany; ComponentLink1URL: N.A.; ComponentLink1Description: Datasheet; ComponentLink2URL: N.A.; ComponentLink2Description: Supplier link; HelpURL: N.A.; LatestRevisionDate: 2023-01-05; Published: 2023-01-05; Footprint Doc: Label; Value: 12x12mm; Supplier 1: N.A.; Supplier Part Number 1: N.A.; Supplier 2: N.A.; Supplier Part Number 2: N.A.; Artikkelnr Noca: N.A.; Part number IPS: N.A.; Part number Norautron: N.A.
LOGO1 = WEEE Symbol 3x4.5mm: WEEE Directive symbol; Manufacturer: N.A.; Part number NEMS: 101100006; Component Status: Active; Pad Count: 0; Part Number: WEEE Symbol 3x4.5mm; PartId: 101100006; Component Class: Markings; Author: rsk; Manufacturer Part Number: N.A.; ComponentLink1URL: N.A.; ComponentLink1Description: Datasheet; ComponentLink2URL: N.A.; ComponentLink2Description: Supplier link; HelpURL: N.A.; LatestRevisionDate: 2023-03-07; Published: 2016-09-07; Footprint Doc: WEE_3x4.5mm; Value: WEE Symbol; Note: N.A.; Supplier 1: N.A.; Supplier Part Number 1: N.A.; Supplier 2: N.A.; Supplier Part Number 2: N.A.; Artikkelnr Noca: N.A.; Part number IPS: N.A.; Part number Norautron: N.A.
LOGO3 = Segger Logo S: Segger logo, small size; Manufacturer: N.A.; Part number NEMS: 101100004; Component Status: Active; Pad Count: 0; Part Number: Segger Logo S; PartId: 101100004; Component Class: Markings; Author: rsk; Manufacturer Part Number: N.A.; ComponentLink1URL: N.A.; ComponentLink1Description: Datasheet; ComponentLink2URL: N.A.; ComponentLink2Description: Supplier link; HelpURL: N.A.; LatestRevisionDate: 2016-09-07; Published: 2016-09-07; Footprint Doc: Segger Logo S; Value: Segger Logo S; Note: N.A.; Supplier 1: N.A.; Supplier Part Number 1: N.A.; Supplier 2: N.A.; Supplier Part Number 2: N.A.; Artikkelnr Noca: N.A.; Part number IPS: N.A.; Part number Norautron: N.A.

## Sheet pca10184_misc.SchDoc: =ProductName + ' - Misc'
size A3; Author: GETR; CompanyName: Nordic Semiconductor; DrawnBy: GETR; DocumentNumber: 5; Revision: 0.7.0; SheetNumber: 5; SheetTotal: 9
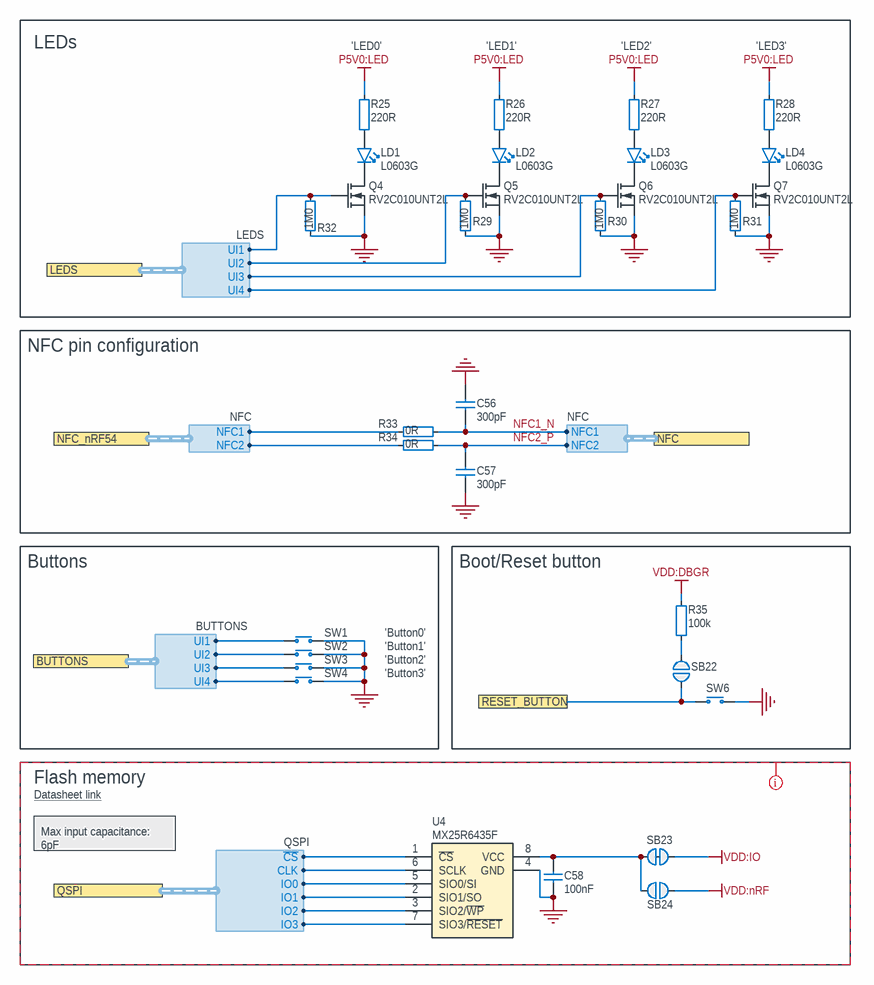
[diagram p6: pca10184_misc.SchDoc]

### Parts
C56  300pF  [CAPC1005X04L]
C57  300pF  [CAPC1005X04L]
C58  100nF  [CAPC0603X03L_C]
LD1  L0603G  [LED_0603_G]
LD2  L0603G  [LED_0603_G]
LD3  L0603G  [LED_0603_G]
LD4  L0603G  [LED_0603_G]
Q4  RV2C010UNT2L  [DFN65P100X40-3L]
Q5  RV2C010UNT2L  [DFN65P100X40-3L]
Q6  RV2C010UNT2L  [DFN65P100X40-3L]
Q7  RV2C010UNT2L  [DFN65P100X40-3L]
R25  220R  [RESC0603X03L_C]
R26  220R  [RESC0603X03L_C]
R27  220R  [RESC0603X03L_C]
R28  220R  [RESC0603X03L_C]
R29  1M0  [RESC0603X03L_C]
R30  1M0  [RESC0603X03L_C]
R31  1M0  [RESC0603X03L_C]
R32  1M0  [RESC0603X03L_C]
R33  0R  [RESC1005X04L]
R34  0R  [RESC1005X04L]
R35  100k  [RESC0603X03L_C]
SB22  Solderbridge  [Solderbridge]  (value not drawn)  (no BOM)
SB23  Solderbridge  [Solderbridge_Shorted]  (value not drawn)  (net tie, no BOM)
SB24  Solderbridge  [Solderbridge]  (value not drawn)  (no BOM)
SW1  PB SW  [Switch-PB-6.2x6.3mm-SMD]  (value not drawn)
SW2  PB SW  [Switch-PB-6.2x6.3mm-SMD]  (value not drawn)
SW3  PB SW  [Switch-PB-6.2x6.3mm-SMD]  (value not drawn)
SW4  PB SW  [Switch-PB-6.2x6.3mm-SMD]  (value not drawn)
SW6  PB SW  [Switch-PB-6.2x6.3mm-SMD]  (value not drawn)
U4  MX25R6435F  [SON127P600X80_HS-9N]

### Blocks framed on the sheet
LEDs: LD1-LD4 Q4-Q7 R25-R32
NFC pin configuration: C56 C57 R33 R34
Buttons: SW1-SW4
Boot/Reset button: R35 SB22 SW6
Flash memory: C58 SB23 SB24 U4

### Ports
BUTTONS (harness BUTTONS), LEDS (harness LEDS), NFC (harness NFC), NFC_nRF54 (harness NFC), QSPI (harness QSPI), RESET_BUTTON

### Harnesses
NFC: NFC2, NFC1
LEDS: UI2, UI1, UI3, UI4
QSPI: ~{CS}, IO0, CLK, IO1, IO2, IO3
BUTTONS: UI2, UI3, UI4, UI1

### Nets
GND: C56.2 C57.1 C58.2 Q4.2(S) Q5.2(S) Q6.2(S) Q7.2(S) R29.2 R30.2 R31.2 R32.2 SW1.1(N.O) SW2.1(N.O) SW3.1(N.O) SW4.1(N.O) SW6.1(N.O) U4.4(GND) U4.9(GND)
P5V0:LED: R25.2 R26.2 R27.2 R28.2
VDD:DBGR: R35.2
VDD:IO: SB23.1
VDD:nRF: SB24.1
NFC1_N: C56.1 R33.2 ; port NFC.NFC1
NFC2_P: C57.2 R34.2 ; port NFC.NFC2
NFC_N: R33.1 ; port NFC_nRF54.NFC1
NFC_P: R34.1 ; port NFC_nRF54.NFC2
P0.05: SW4.2(COM) ; port BUTTONS.UI4
P1.08: SW3.2(COM) ; port BUTTONS.UI3
P1.09: SW2.2(COM) ; port BUTTONS.UI2
P1.22: Q4.1(G) R32.1 ; port LEDS.UI1
P1.25: Q5.1(G) R29.1 ; port LEDS.UI2
P1.26: SW1.2(COM) ; port BUTTONS.UI1
P1.27: Q6.1(G) R30.1 ; port LEDS.UI3
P1.28: Q7.1(G) R31.1 ; port LEDS.UI4
P2.00_B: U4.7(SIO3/~{RESET}) ; port QSPI.IO3
P2.01_B: U4.6(SCLK) ; port QSPI.CLK
P2.02_B: U4.5(SIO0/SI) ; port QSPI.IO0
P2.03_B: U4.3(SIO2/~{WP}) ; port QSPI.IO2
P2.04_B: U4.2(SIO1/SO) ; port QSPI.IO1
P2.05_B: U4.1(~{CS}) ; port QSPI.~{CS}
NetC58_1: C58.1 SB23.2 SB24.2 U4.8(VCC)
NetLD1_1: LD1.1(C) Q4.3(D)
NetLD1_2: LD1.2(A) R25.1
NetLD2_1: LD2.1(C) Q5.3(D)
NetLD2_2: LD2.2(A) R26.1
NetLD3_1: LD3.1(C) Q6.3(D)
NetLD3_2: LD3.2(A) R27.1
NetLD4_1: LD4.1(C) Q7.3(D)
NetLD4_2: LD4.2(A) R28.1
NetR35_1: R35.1 SB22.2
NetSB22_1: SB22.1 SW6.2(COM) ; port RESET_BUTTON

### Layout directives
CompClassName: Flash: GND, VDD:IO, VDD:nRF

### Notes on the sheet
- (near R25) 'LED0'
- (near R26) 'LED1'
- (near R27) 'LED2'
- (near R28) 'LED3'
- 'Button1'
- 'Button2'
- 'Button3'
- 'Button0'
- Datasheet link <https://www.mxic.com.tw/Lists/Datasheet/Attachments/8868/MX25R6435F,%20Wide%20Range,%2064Mb,%20v1.6.pdf>
- Max input capacitance: 6pF
- Title
- Size
- Date:
- File:
- A3
- PCB Assembly Number
- Sheet
- Drawn By:
- Revision
- of
- Classification:

### Library data of the parts
C56 C57 = C0402-300p: Capacitor, C0G, ±5%, 50V; Manufacturer: N.A.; Part number IPS: 00000007788; Part number NEMS: 100200155; Artikkelnr Noca: 20020004; Pad Count: 2; Component Status: Active; Part Number: C0402-300p; Manufacturer Part Number: N.A.; Footprint Doc: 0402; LatestRevisionDate: 2020-10-13; Published: 2015-05-29; Value: 300pF; Note: 50V; ComponentLink1URL: N.A.; ComponentLink1Description: Datasheet; ComponentLink2URL: N.A.; ComponentLink2Description: Supplier link; HelpURL: N.A.; Supplier 1: Digi-Key; Supplier Part Number 1: 490-3234-1-ND; Supplier 2: N.A.; Supplier Part Number 2: N.A.; Component Class: Capacitors; PartId: 100200155; Author: rsk; Part number Norautron: N.A.
C58 = C0201-100n: as C63 on sheet pca10184_connectors; Part Number: C0201-100n; Value: 100nF; Footprint Doc: 0201; Component Class: Capacitors; Author: rsk; PartId: 100200078; Manufacturer Part Number: N.A.; ComponentLink1URL: N.A.; ComponentLink1Description: Datasheet; ComponentLink2URL: N.A.; ComponentLink2Description: Supplier link; HelpURL: N.A.; LatestRevisionDate: 2024-06-27; Published: 2014-11-13; Note: 16V; Supplier 1: N.A.; Supplier Part Number 1: N.A.; Supplier 2: N.A.; Supplier Part Number 2: N.A.; Artikkelnr Noca: N.A.
LD1-LD4 = VS 25C7M5: LED, Green, 0603, 573nm, Vf=2.0V, 24mcd, - 40 to +85°C; Manufacturer: Victory Electronics; Part number IPS: 00000001274, 00000009961; Part number Norautron: 26313411; Part number NEMS: 101400097; Pad Count: 2; Note: N.A.; Artikkelnr Noca: 13019193; Component Status: Active; Part Number: VS 25C7M5; PartId: 101400097; Component Class: Optoelectronics; Author: rsk; Manufacturer Part Number: VS 25C7M5; ComponentLink1URL: N.A.; ComponentLink1Description: Datasheet; ComponentLink2URL: N.A.; ComponentLink2Description: Supplier link; HelpURL: \\hizz\pro\app9717\Datasheet\optoelectronics\Victory Electronics\VS 25C7M5.pdf; Footprint Doc: 0603; LatestRevisionDate: 2020-10-23; Published: 2017-08-21; Value: L0603G; Supplier 1: EC Partner; Supplier Part Number 1: N.A.; Supplier 2: N.A.; Supplier Part Number 2: N.A.
Q4-Q7 = RV2C010UNT2L: N-Channel MOSFET, 20V, 1A, 470mOhm, 400mW, -55°C ~ 150°C; Manufacturer: Rohm Semiconductor; Part number IPS: 00000009976; Part number Norautron: 26320026; Part number NEMS: 101300132; Note: N.A.; Artikkelnr Noca: 35010020; Pad Count: 3; Component Status: Active; Part Number: RV2C010UNT2L; Manufacturer Part Number: RV2C010UNT2L; ComponentLink1URL: N.A.; ComponentLink1Description: Datasheet; ComponentLink2URL: N.A.; ComponentLink2Description: Supplier link; HelpURL: http://rohmfs.rohm.com/en/products/databook/datasheet/discrete/transistor/mosfet/rv2c010unt2l-e.pdf; Footprint Doc: DFN-3; LatestRevisionDate: 2024-09-18; Published: 2016-08-09; Value: RV2C010UNT2L; Supplier 1: Digi-Key; Supplier Part Number 1: RV2C010UNT2LCT-ND; Supplier 2: Mouser; Supplier Part Number 2: 755-RV2C010UNT2L; PartId: 101300132; Component Class: Semiconductors; Author: rsk
R25-R28 = R0201-220: Resistor, ±1%, 0.05W; Manufacturer: N.A.; Part number IPS: 00000000863; Part number Norautron: 26107014; Part number NEMS: 100100032; Note: Chip Res 1%; Pad Count: 2; Component Status: Active; Part Number: R0201-220; Manufacturer Part Number: N.A.; LatestRevisionDate: 2014-11-13; Published: 2014-11-13; Value: 220R; Artikkelnr Noca: N.A.; Footprint Doc: 0201; ComponentLink1URL: N.A.; ComponentLink1Description: Datasheet; ComponentLink2URL: N.A.; ComponentLink2Description: Supplier link; HelpURL: N.A.; Supplier 1: N.A.; Supplier Part Number 1: N.A.; Supplier 2: N.A.; Supplier Part Number 2: N.A.; Component Class: Resistors; PartId: 100100032; Author: rsk
R29-R32 = R0201-1M0: Resistor, ±1%, 0.05W; Manufacturer: N.A.; Part number IPS: 00000001418; Part number Norautron: 26107108; Part number NEMS: 100100093; Component Status: Active; Pad Count: 2; Note: Chip Res 1%; Part Number: R0201-1M0; PartId: 100100093; Component Class: Resistors; Author: rsk; Manufacturer Part Number: N.A.; ComponentLink1URL: N.A.; ComponentLink1Description: Datasheet; ComponentLink2URL: N.A.; ComponentLink2Description: Supplier link; HelpURL: N.A.; LatestRevisionDate: 2014-11-13; Published: 2014-11-13; Footprint Doc: 0201; Value: 1M0; Supplier 1: N.A.; Supplier Part Number 1: N.A.; Supplier 2: N.A.; Supplier Part Number 2: N.A.; Artikkelnr Noca: N.A.
R33 R34 = R0402-0R: Resistor, ±5%, 0.063W; Manufacturer: N.A.; Part number IPS: 00000007128; Part number NEMS: 100100109; Component Status: Active; Pad Count: 2; Note: Chip Res 5%; Artikkelnr Noca: 27049000; Part Number: R0402-0R; PartId: 100100109; Component Class: Resistors; Author: rsk; Manufacturer Part Number: N.A.; ComponentLink1URL: N.A.; ComponentLink1Description: Datasheet; ComponentLink2URL: N.A.; ComponentLink2Description: Supplier link; HelpURL: N.A.; LatestRevisionDate: 2009-11-23; Published: 2009-05-08; Footprint Doc: 0402; Value: 0R; Supplier 1: Farnell; Supplier Part Number 1: 146-9661; Supplier 2: N.A.; Supplier Part Number 2: N.A.; Part number Norautron: N.A.
R35 = R0201-100k: Resistor, ±1%, 0.05W; Manufacturer: N.A.; Part number IPS: 00000001419; Part number Norautron: 26108487; Part number NEMS: 100100080; Note: Chip Res 1%; Pad Count: 2; Component Status: Active; Part Number: R0201-100k; Manufacturer Part Number: N.A.; Footprint Doc: 0201; LatestRevisionDate: 2014-11-13; Published: 2014-11-13; Value: 100k; Artikkelnr Noca: N.A.; ComponentLink1URL: N.A.; ComponentLink1Description: Datasheet; ComponentLink2URL: N.A.; ComponentLink2Description: Supplier link; HelpURL: N.A.; Supplier 1: N.A.; Supplier Part Number 1: N.A.; Supplier 2: N.A.; Supplier Part Number 2: N.A.; Component Class: Resistors; PartId: 100100080; Author: rsk
SB22 SB24 = Solderbridge: Manufacturer: N.A.; Part number NEMS: 100500458; Pad Count: 2; Component Status: Active; System: Connector; Part Number: Solderbridge; Manufacturer Part Number: N.A.; LatestRevisionDate: 2009-12-14; Published: 2009-12-14; Value: Solderbridge; Note: N.A.; Artikkelnr Noca: N.A.; Footprint Doc: Solderbridge; Part number IPS: N.A.; ComponentLink1URL: N.A.; ComponentLink1Description: Datasheet; ComponentLink2URL: N.A.; ComponentLink2Description: Supplier link; HelpURL: N.A.; Supplier 1: N.A.; Supplier Part Number 1: N.A.; Supplier 2: N.A.; Supplier Part Number 2: N.A.; Component Class: Connectors; PartId: 100500458; Author: rsk; Part number Norautron: N.A.
SB23 = Solderbridge Shorted: Shorted Solderbridge; Manufacturer: N.A.; Part number NEMS: 100500459; Pad Count: 2; Component Status: Active; System: Connector; Part Number: Solderbridge Shorted; Manufacturer Part Number: N.A.; LatestRevisionDate: 2012-08-07; Published: 2012-08-07; Value: Solderbridge; Note: N.A.; Artikkelnr Noca: N.A.; Footprint Doc: Solderbridge_Shorted; Part number IPS: N.A.; ComponentLink1URL: N.A.; ComponentLink1Description: Datasheet; ComponentLink2URL: N.A.; ComponentLink2Description: Supplier link; HelpURL: N.A.; Supplier 1: N.A.; Supplier Part Number 1: N.A.; Supplier 2: N.A.; Supplier Part Number 2: N.A.; Component Class: Connectors; PartId: 100500459; Author: rsk; Part number Norautron: N.A.
SW1-SW4 SW6 = Switch-PB-6.2x6.3mm-SMD: Tactile Switch, SPNO, SMD, 160gf, 6.2x6.3x2.5mm; Manufacturer: Dailywell; Manufacturer Part Number: TS604VM1-025BR-R; Part number IPS: 00000007812; Part number NEMS: 101500001, 101500133; Note: N.A.; Artikkelnr Noca: 50019106; Pad Count: 4; Component Status: Active; Part Number: Switch-PB-6.2x6.3mm-SMD; Footprint Doc: Switch-PB-6.2x6.3mm-SMD; LatestRevisionDate: 2016-04-21; Published: 2010-02-01; Value: PB SW; ComponentLink1URL: N.A.; ComponentLink1Description: Datasheet; ComponentLink2URL: N.A.; ComponentLink2Description: Supplier link; HelpURL: \\hizz\pro\app9717\Datasheet\switches\Dailywell\TS604VM1-025BR-R.pdf; Supplier 1: Cabcon; Supplier Part Number 1: TS604VM1-025BR-R; Supplier 2: Mouser; Supplier Part Number 2: 688-SKHUALE010; Component Class: Switches; PartId: 101500001; Author: rsk; Part number Norautron: N.A.
U4 = MX25R6435FZNIL0: Ultra low power, 64M-bit, serial multi I/O flash memory; Manufacturer: Macronix; Part number IPS: 00000004370; Part number NEMS: 101900438; Note: N.A.; Artikkelnr Noca: 15020015; Pad Count: 8; Component Status: Active; Part Number: MX25R6435FZNIL0; Manufacturer Part Number: MX25R6435FZNIL0; Footprint Doc: WSON-8; LatestRevisionDate: 2021-02-26; Published: 2016-06-29; Value: MX25R6435F; ComponentLink1URL: N.A.; ComponentLink1Description: Datasheet; ComponentLink2URL: N.A.; ComponentLink2Description: Supplier link; HelpURL: https://www.macronix.com/Lists/Datasheet/Attachments/7913/MX25R6435F,%20Wide%20Range,%2064Mb,%20v1.5.pdf; Supplier 1: Future; Supplier Part Number 1: MX25R6435FZNIL0; Supplier 2: Arrow; Supplier Part Number 2: MX25R6435FZNIL0; Component Class: Misc_ICs; PartId: 101900438; Author: rsk; Part number Norautron: N.A.